# Altium schematic sheet MEMORY2.SchDoc
size A; SheetNumber: 5; SheetTotal: 6
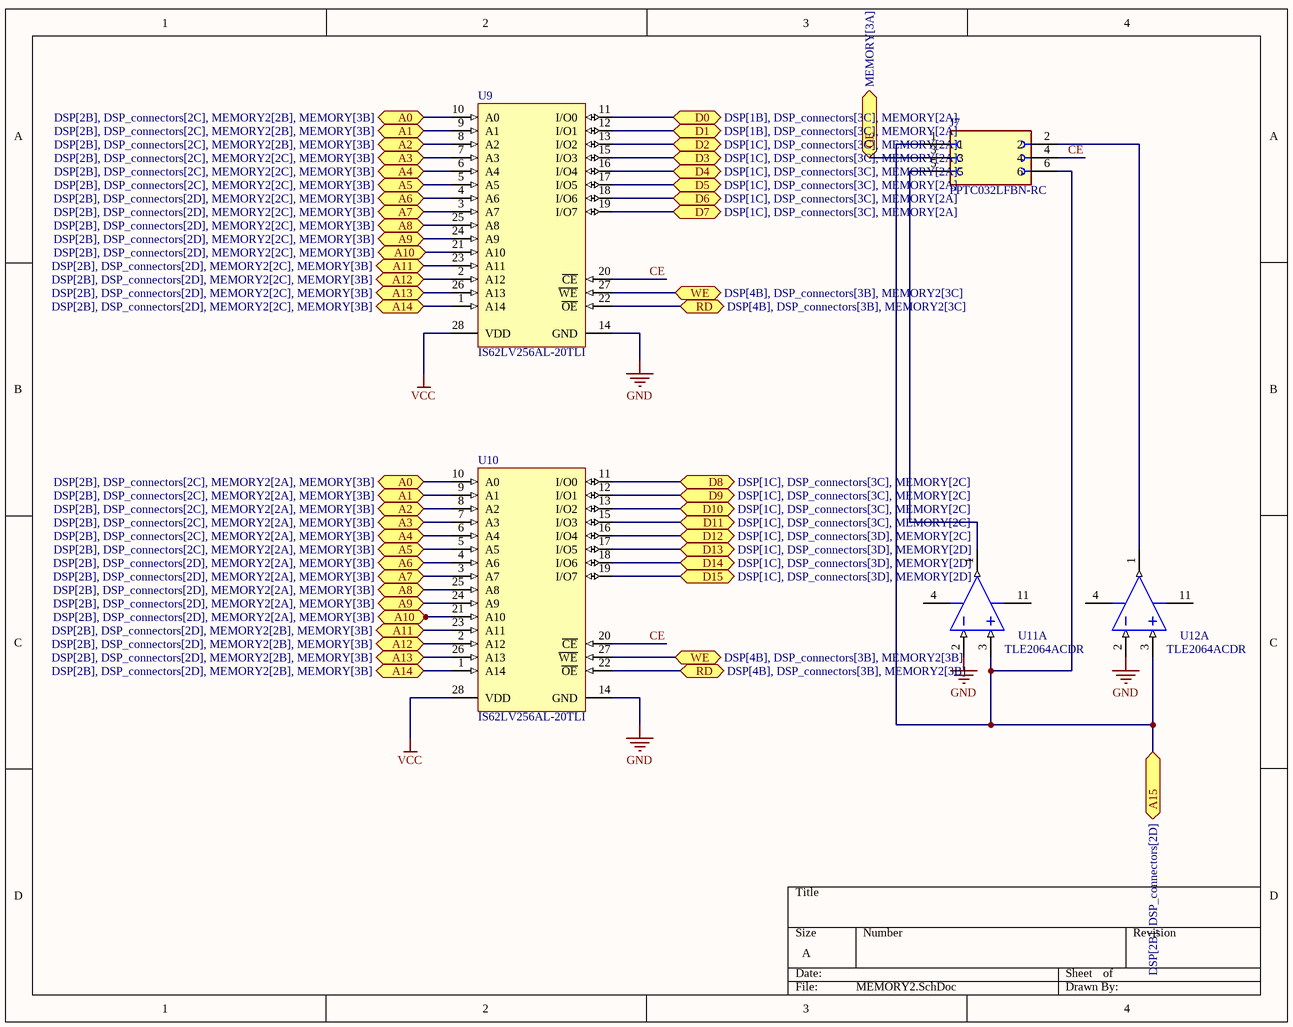
[diagram p0: MEMORY2.SchDoc]

## Parts
J7  PPTC032LFBN-RC  [SULLINS_PPTC032LFBN-RC]
U9  IS62LV256AL-20TLI  [ISSI-TSOP-1-28-8000X13400DE_N]
U10  IS62LV256AL-20TLI  [ISSI-TSOP-1-28-8000X13400DE_N]
U11  TLE2064ACDR  [D0014A_M]  (part A of 4)
U12  TLE2064ACDR  [D0014A_M]  (part A of 4)

## Ports
A0 (bidir, see DSP[2B], DSP_connectors[2C], MEMORY2[2A], MEMORY[3B]), A0 (bidir, see DSP[2B], DSP_connectors[2C], MEMORY2[2B], MEMORY[3B]), A1 (bidir, see DSP[2B], DSP_connectors[2C], MEMORY2[2A], MEMORY[3B]), A1 (bidir, see DSP[2B], DSP_connectors[2C], MEMORY2[2B], MEMORY[3B]), A2 (bidir, see DSP[2B], DSP_connectors[2C], MEMORY2[2A], MEMORY[3B]), A2 (bidir, see DSP[2B], DSP_connectors[2C], MEMORY2[2B], MEMORY[3B]), A3 (bidir, see DSP[2B], DSP_connectors[2C], MEMORY2[2A], MEMORY[3B]), A3 (bidir, see DSP[2B], DSP_connectors[2C], MEMORY2[2C], MEMORY[3B]), A4 (bidir, see DSP[2B], DSP_connectors[2C], MEMORY2[2A], MEMORY[3B]), A4 (bidir, see DSP[2B], DSP_connectors[2C], MEMORY2[2C], MEMORY[3B]), A5 (bidir, see DSP[2B], DSP_connectors[2C], MEMORY2[2A], MEMORY[3B]), A5 (bidir, see DSP[2B], DSP_connectors[2C], MEMORY2[2C], MEMORY[3B]), A6 (bidir, see DSP[2B], DSP_connectors[2D], MEMORY2[2A], MEMORY[3B]), A6 (bidir, see DSP[2B], DSP_connectors[2D], MEMORY2[2C], MEMORY[3B]), A7 (bidir, see DSP[2B], DSP_connectors[2D], MEMORY2[2A], MEMORY[3B]), A7 (bidir, see DSP[2B], DSP_connectors[2D], MEMORY2[2C], MEMORY[3B]), A8 (bidir, see DSP[2B], DSP_connectors[2D], MEMORY2[2A], MEMORY[3B]), A8 (bidir, see DSP[2B], DSP_connectors[2D], MEMORY2[2C], MEMORY[3B]), A9 (bidir, see DSP[2B], DSP_connectors[2D], MEMORY2[2A], MEMORY[3B]), A9 (bidir, see DSP[2B], DSP_connectors[2D], MEMORY2[2C], MEMORY[3B]), A10 (bidir, see DSP[2B], DSP_connectors[2D], MEMORY2[2A], MEMORY[3B]), A10 (bidir, see DSP[2B], DSP_connectors[2D], MEMORY2[2C], MEMORY[3B]), A11 (bidir, see DSP[2B], DSP_connectors[2D], MEMORY2[2B], MEMORY[3B]), A11 (bidir, see DSP[2B], DSP_connectors[2D], MEMORY2[2C], MEMORY[3B]), A12 (bidir, see DSP[2B], DSP_connectors[2D], MEMORY2[2B], MEMORY[3B]), A12 (bidir, see DSP[2B], DSP_connectors[2D], MEMORY2[2C], MEMORY[3B]), A13 (bidir, see DSP[2B], DSP_connectors[2D], MEMORY2[2B], MEMORY[3B]), A13 (bidir, see DSP[2B], DSP_connectors[2D], MEMORY2[2C], MEMORY[3B]), A14 (bidir, see DSP[2B], DSP_connectors[2D], MEMORY2[2B], MEMORY[3B]), A14 (bidir, see DSP[2B], DSP_connectors[2D], MEMORY2[2C], MEMORY[3B]), A15 (bidir, see DSP[2B], DSP_connectors[2D]), D0 (bidir, see DSP[1B], DSP_connectors[3C], MEMORY[2A]), D1 (bidir, see DSP[1B], DSP_connectors[3C], MEMORY[2A]), D2 (bidir, see DSP[1C], DSP_connectors[3C], MEMORY[2A]), D3 (bidir, see DSP[1C], DSP_connectors[3C], MEMORY[2A]), D4 (bidir, see DSP[1C], DSP_connectors[3C], MEMORY[2A]), D5 (bidir, see DSP[1C], DSP_connectors[3C], MEMORY[2A]), D6 (bidir, see DSP[1C], DSP_connectors[3C], MEMORY[2A]), D7 (bidir, see DSP[1C], DSP_connectors[3C], MEMORY[2A]), D8 (bidir, see DSP[1C], DSP_connectors[3C], MEMORY[2C]), D9 (bidir, see DSP[1C], DSP_connectors[3C], MEMORY[2C]), D10 (bidir, see DSP[1C], DSP_connectors[3C], MEMORY[2C]), D11 (bidir, see DSP[1C], DSP_connectors[3C], MEMORY[2C]), D12 (bidir, see DSP[1C], DSP_connectors[3D], MEMORY[2C]), D13 (bidir, see DSP[1C], DSP_connectors[3D], MEMORY[2D]), D14 (bidir, see DSP[1C], DSP_connectors[3D], MEMORY[2D]), D15 (bidir, see DSP[1C], DSP_connectors[3D], MEMORY[2D]), OE (bidir, see MEMORY[3A]), RD (bidir, see DSP[4B], DSP_connectors[3B], MEMORY2[3B]), RD (bidir, see DSP[4B], DSP_connectors[3B], MEMORY2[3C]), WE (bidir, see DSP[4B], DSP_connectors[3B], MEMORY2[3B]), WE (bidir, see DSP[4B], DSP_connectors[3B], MEMORY2[3C])

## Nets
GND: U9.14(GND) U10.14(GND) U11.2(IN1-) U12.2(IN1-)
VCC: U9.28(VDD) U10.28(VDD)
A0: U9.10(A0) U10.10(A0) ; port A0
A1: U9.9(A1) U10.9(A1) ; port A1
A2: U9.8(A2) U10.8(A2) ; port A2
A3: U9.7(A3) U10.7(A3) ; port A3
A4: U9.6(A4) U10.6(A4) ; port A4
A5: U9.5(A5) U10.5(A5) ; port A5
A6: U9.4(A6) U10.4(A6) ; port A6
A7: U9.3(A7) U10.3(A7) ; port A7
A8: U9.25(A8) U10.25(A8) ; port A8
A9: U9.24(A9) U10.24(A9) ; port A9
A10: U9.21(A10) U10.21(A10) ; port A10
A11: U9.23(A11) U10.23(A11) ; port A11
A12: U9.2(A12) U10.2(A12) ; port A12
A13: U9.26(A13) U10.26(A13) ; port A13
A14: U9.1(A14) U10.1(A14) ; port A14
A15: J7.1 J7.6 U11.3(IN1+) U12.3(IN1+) ; port A15
CE: J7.4 U9.20(~{CE}) U10.20(~{CE})
D0: U9.11(I/O0) ; port D0
D1: U9.12(I/O1) ; port D1
D2: U9.13(I/O2) ; port D2
D3: U9.15(I/O3) ; port D3
D4: U9.16(I/O4) ; port D4
D5: U9.17(I/O5) ; port D5
D6: U9.18(I/O6) ; port D6
D7: U9.19(I/O7) ; port D7
D8: U10.11(I/O0) ; port D8
D9: U10.12(I/O1) ; port D9
D10: U10.13(I/O2) ; port D10
D11: U10.15(I/O3) ; port D11
D12: U10.16(I/O4) ; port D12
D13: U10.17(I/O5) ; port D13
D14: U10.18(I/O6) ; port D14
D15: U10.19(I/O7) ; port D15
OE: J7.3 ; port OE
RD: U9.22(~{OE}) U10.22(~{OE}) ; port RD
WE: U9.27(~{WE}) U10.27(~{WE}) ; port WE
NetJ7_2: J7.2 U12.1(OUT1)
NetJ7_5: J7.5 U11.1(OUT1)

Not connected (* = marked no-connect by the designer): U11 4(VCC+) 11(VCC-); U12 4(VCC+) 11(VCC-)

## Library data of the parts
J7 = PPTC032LFBN-RC: 6 Position Header Connector 0.100 (2.54mm) Through Hole Tin; MF: Sullins Connector Solutions; Package: None; Price: None; Value: *; SnapEDA_Link: https://www.snapeda.com/parts/PPTC032LFBN-RC/Sullins+Connector+Solutions/view-part/?ref=snap; MP: PPTC032LFBN-RC; Availability: Not in stock; Check_prices: https://www.snapeda.com/parts/PPTC032LFBN-RC/Sullins+Connector+Solutions/view-part/?ref=eda
U9 U10 = CMP-0515-00096-2: 256 K Low Voltage CMOS SRAM, 32 K x 8, -40 to 85 degC, 28-Pin SOP (TSOP-1-28), Pb-Free; Manufacturer: Integrated Silicon Solution Inc (ISSI); Density: 256K; Organization: 32K x 8; Speed (ns): 20; Packing: Tray / Tube; RoHS: Pb-Free; ComponentLink2Description: Datasheet; Mounting Technology: Surface Mount; ComponentLink2URL: http://www.issi.com/WW/pdf/62-65LV256AL.pdf; ComponentLink3URL: http://www.issi.com/WW/pdf/62-65C256AL.pdf; ComponentLink1URL: http://www.issi.com/US/index.shtml; ComponentLink1Description: Manufacturer URL; ComponentLink3Description: Package Specification; PackageVersion: Rev. F, 09/2009; PackageReference: TSOP-1-28; Code_JEDEC: MO- 183; PartNumber: IS62LV256AL-20TLI; PackageDescription: 28-Pin 8 x 13.4 mm TSOP-1, Pitch 0.55 mm; DatasheetVersion: Rev. C
U11 U12 = CMP-0272-01885-3: Excalibur JFET-Input High-Output-Drive uPower Quad Operational Amplifier, 7 to 36 V, 0 to70 degC, 14-pin SOIC (D14), Green (RoHS & no Sb/Br); Manufacturer: Texas Instruments; IIB(Max)(pA): 2000; Vio (25C)(Max)(mV): 6; Total Supply Voltage(Min)(+5V is 5, +/-5V is 10): 7; Rating: Catalog; Sub Family: High Supply Voltage Amplifier (>=30V), Low Power Amp (<=500uA), Precision Amplifier; CMRR(Min)(dB): 65; Packing: LARGE T&R; Total Supply Voltage(Max)(+5V is 5, +/-5V is 10): 36; Number of Channels: 4; Iq per channel(Max)(mA): 0.325; Slew Rate(Typ)(V/us): 3.4; GBW(Typ)(MHz): 1.8; Code_JEDEC: MS-012; Eco-Plan: Green (RoHS & no Sb/Br); ComponentLink2Description: Datasheet; PackageVersion: 4040047-5/M, 06/2011; ComponentLink3Description: Package Specification; Offset Drift(Typ)(uV/C): 6; PackageDescription: 14-Pin Plastic Small Outline, Body 8.65 x 3.9 mm, Pitch 1.27 mm; Mounting Technology: Surface Mount; PackageReference: D0014A; ComponentLink2URL: http://www.ti.com/lit/ds/symlink/tle2064a.pdf; DatasheetVersion: SLOS193B; ComponentLink3URL: http://www.ti.com/lit/ml/mpds177g/mpds177g.pdf; PartNumber: TLE2064ACDR; ComponentLink1Description: Manufacturer URL; ComponentLink1URL: http://www.ti.com/